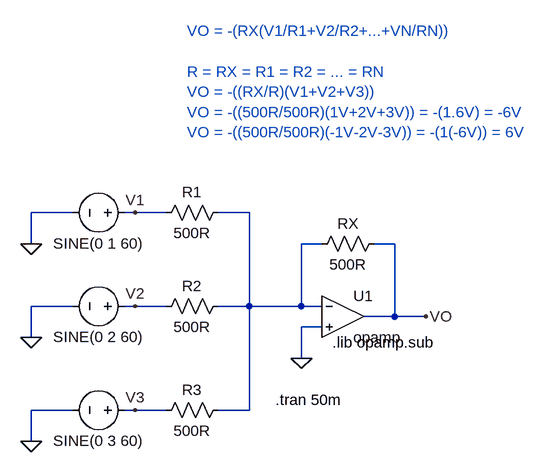
[diagram p0: schematic AMP05 - O Amplificador Somador Inversor.asc]
AMP05 - O Amplificador Somador Inversor.asc, the LTspice schematic file:
Version 4
SHEET 1 880 680
WIRE -240 -32 -304 -32
WIRE -144 -32 -160 -32
WIRE -96 -32 -144 -32
WIRE 32 -32 -16 -32
WIRE -304 16 -304 -32
WIRE 144 16 112 16
WIRE 256 16 224 16
WIRE -240 112 -304 112
WIRE -144 112 -160 112
WIRE -96 112 -144 112
WIRE 32 112 32 -32
WIRE 32 112 -16 112
WIRE 112 112 112 16
WIRE 112 112 32 112
WIRE 144 112 112 112
WIRE 256 128 256 16
WIRE 256 128 208 128
WIRE 304 128 256 128
WIRE 144 144 112 144
WIRE -304 160 -304 112
WIRE 112 192 112 144
WIRE -240 272 -304 272
WIRE -144 272 -160 272
WIRE -96 272 -144 272
WIRE 32 272 32 112
WIRE 32 272 -16 272
WIRE -304 320 -304 272
FLAG 112 192 0
FLAG 304 128 VO
FLAG -304 16 0
FLAG -304 160 0
FLAG -304 320 0
FLAG -144 -32 V1
FLAG -144 112 V2
FLAG -144 272 V3
SYMBOL Opamps\\opamp 176 64 R0
SYMATTR InstName U1
SYMBOL res 240 0 R90
WINDOW 0 0 56 VBottom 2
WINDOW 3 32 56 VTop 2
SYMATTR InstName RX
SYMATTR Value 500R
SYMBOL voltage -144 -32 R90
WINDOW 0 -32 56 Invisible 2
WINDOW 3 32 56 VTop 2
WINDOW 123 0 0 Left 2
WINDOW 39 0 0 Left 2
SYMATTR InstName V1
SYMATTR Value SINE(0 1 60)
SYMBOL voltage -144 112 R90
WINDOW 0 -32 56 Invisible 2
WINDOW 3 32 56 VTop 2
WINDOW 123 0 0 Left 2
WINDOW 39 0 0 Left 2
SYMATTR InstName V2
SYMATTR Value SINE(0 2 60)
SYMBOL voltage -144 272 R90
WINDOW 0 -32 56 Invisible 2
WINDOW 3 32 56 VTop 2
WINDOW 123 0 0 Left 2
WINDOW 39 0 0 Left 2
SYMATTR InstName V3
SYMATTR Value SINE(0 3 60)
SYMBOL res 0 -48 R90
WINDOW 0 0 56 VBottom 2
WINDOW 3 32 56 VTop 2
SYMATTR InstName R1
SYMATTR Value 500R
SYMBOL res 0 96 R90
WINDOW 0 0 56 VBottom 2
WINDOW 3 32 56 VTop 2
SYMATTR InstName R2
SYMATTR Value 500R
SYMBOL res 0 256 R90
WINDOW 0 0 56 VBottom 2
WINDOW 3 32 56 VTop 2
SYMATTR InstName R3
SYMATTR Value 500R
TEXT 160 168 Left 2 !.lib opamp.sub
TEXT -64 -312 Left 2 ;VO = -(RX(V1/R1+V2/R2+...+VN/RN))\n \nR = RX = R1 = R2 = ... = RN \nVO = -((RX/R)(V1+V2+V3))\nVO = -((500R/500R)(1V+2V+3V)) = -(1.6V) = -6V\nVO = -((500R/500R)(-1V-2V-3V)) = -(1(-6V)) = 6V
TEXT 72 256 Left 2 !.tran 50m

The netlist it stands for:
* AMP05 - O Amplificador Somador Inversor.asc
XU1 N001 0 VO opamp Aol=100K GBW=10Meg  ; pins invin noninvin out
RX VO N001 500R
V1 V1 0 SINE(0 1 60)
V2 V2 0 SINE(0 2 60)
V3 V3 0 SINE(0 3 60)
R1 N001 V1 500R
R2 N001 V2 500R
R3 N001 V3 500R
.lib opamp.sub
* VO = -(RX(V1/R1+V2/R2+...+VN/RN))
* R = RX = R1 = R2 = ... = RN
* VO = -((RX/R)(V1+V2+V3))
* VO = -((500R/500R)(1V+2V+3V)) = -(1.6V) = -6V
* VO = -((500R/500R)(-1V-2V-3V)) = -(1(-6V)) = 6V
.tran 50m
.backanno
.end